# Altium schematic sheet 02_B2B_CON_P1-P100.SchDoc: PiMX8MP Board to board connector P1 - P100
size 420 x 297 mm; Author: T. Ludemann; SheetNumber: 2; SheetTotal: 8; DocSize: DINA3
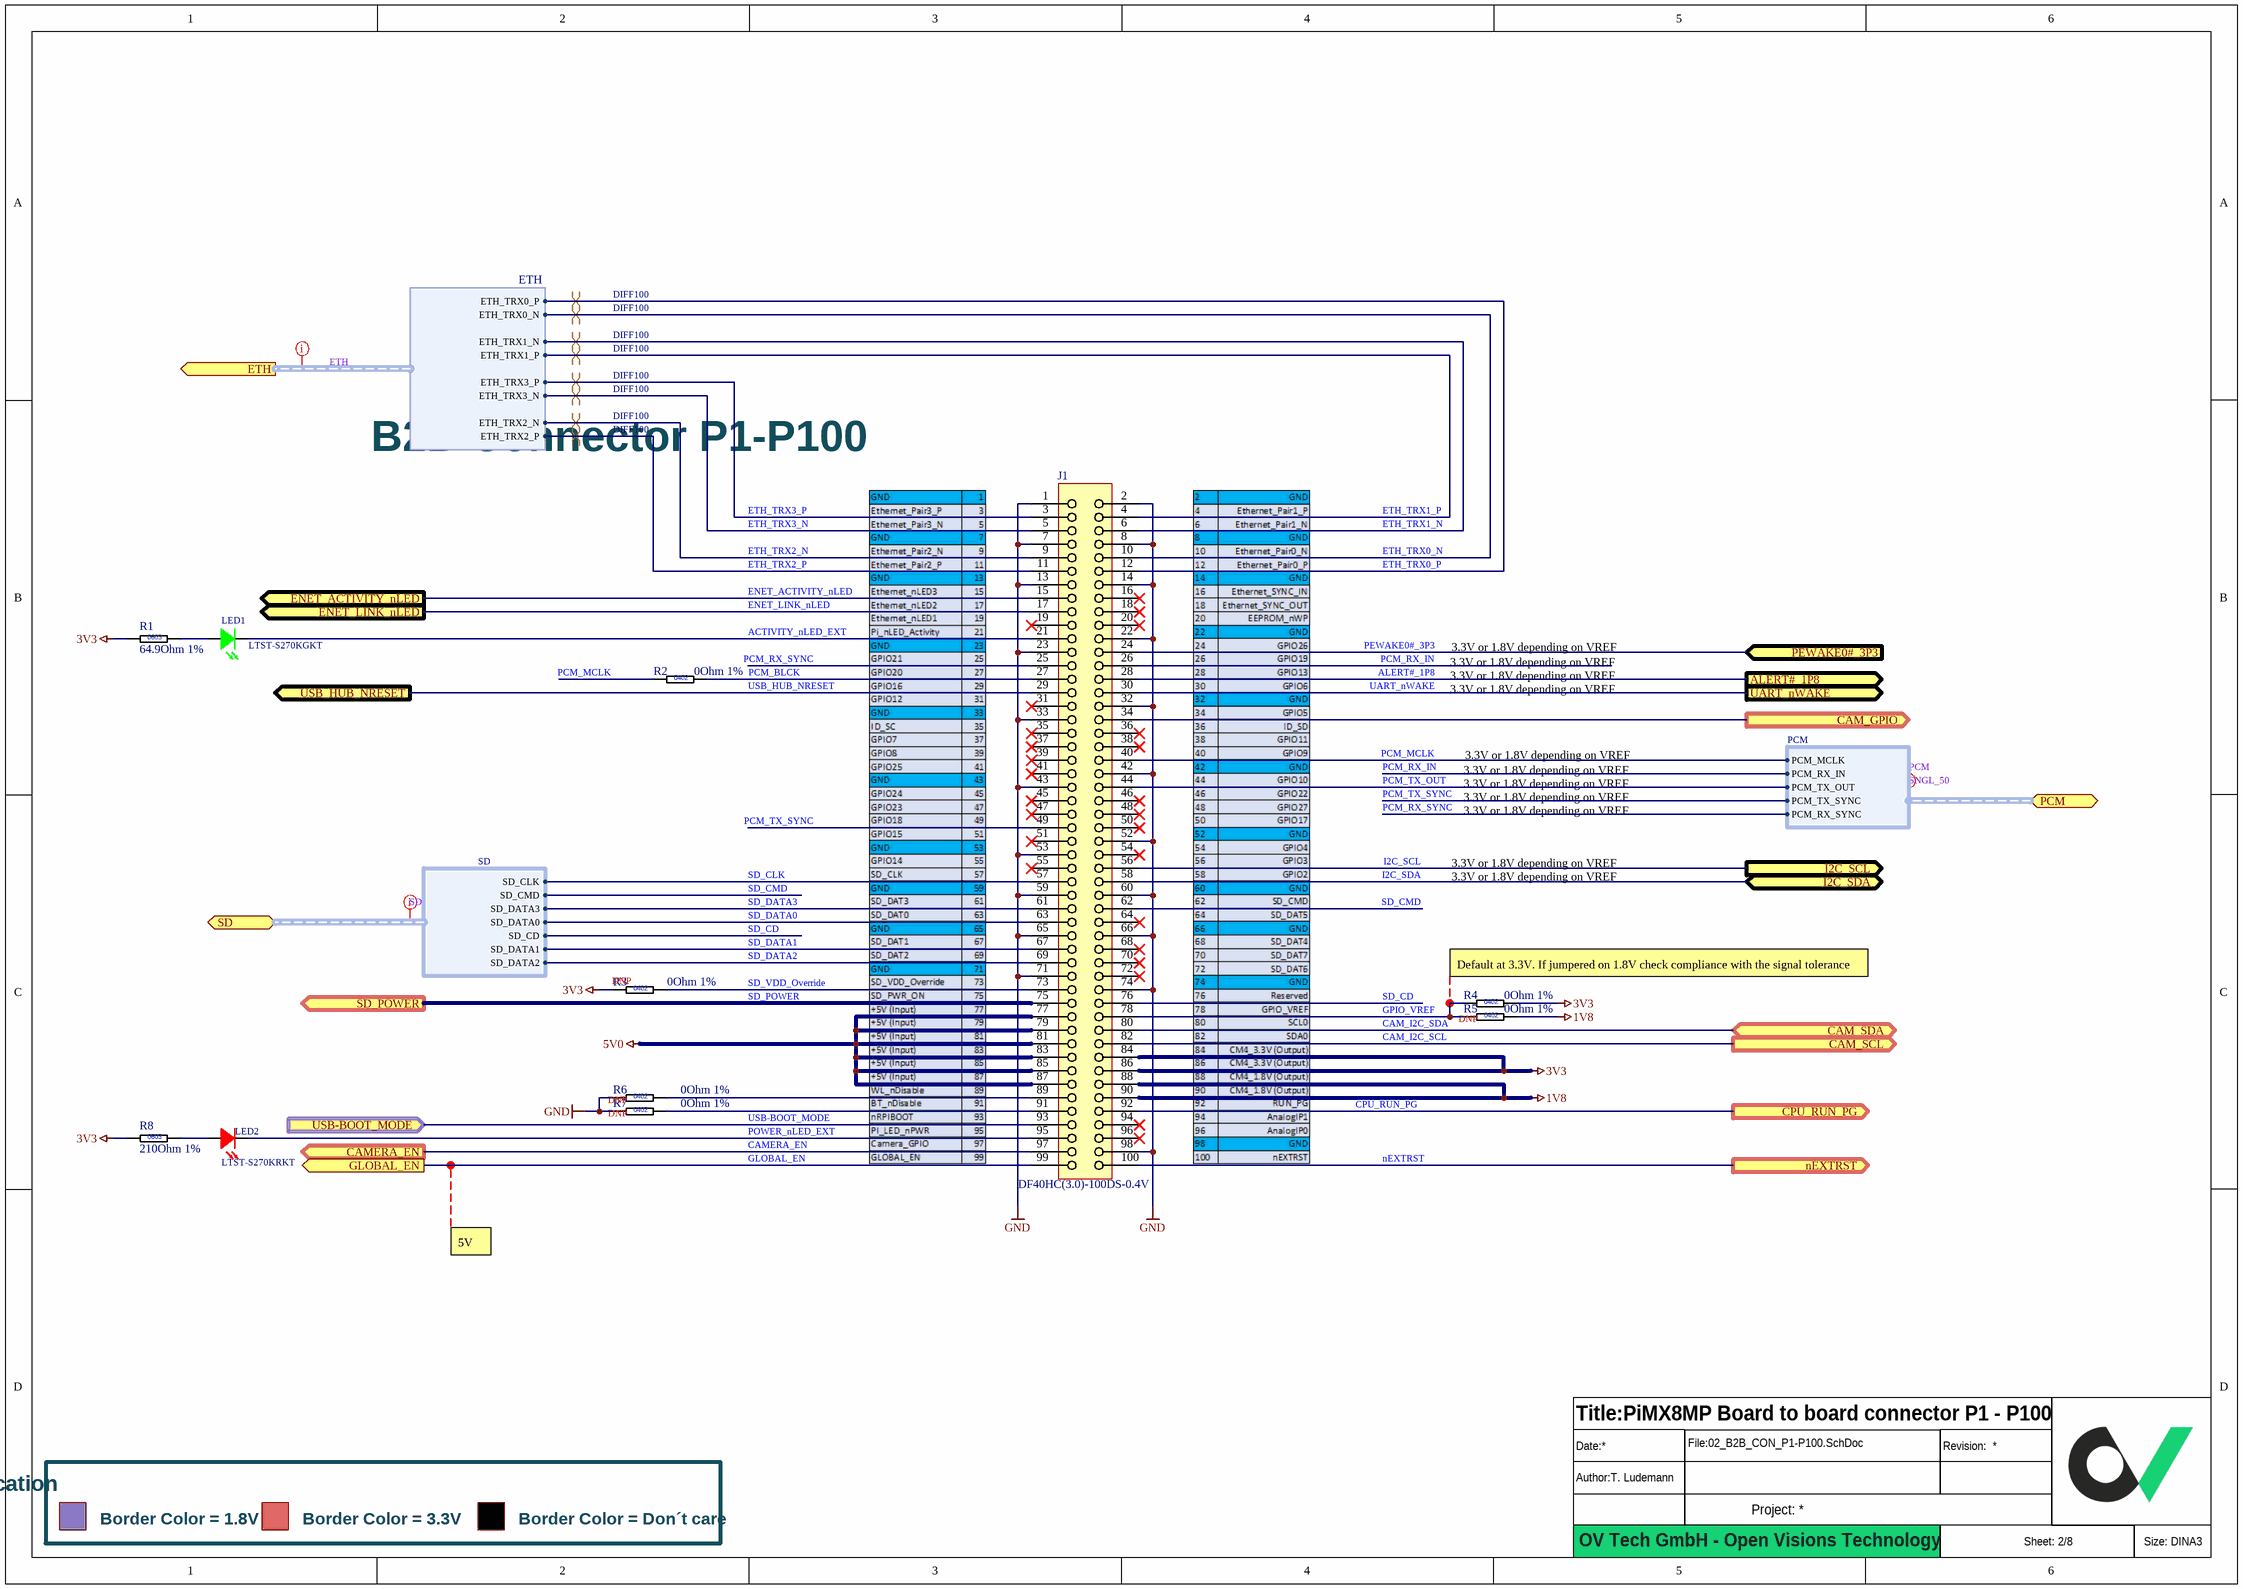
[diagram p0: 02_B2B_CON_P1-P100.SchDoc]

## Parts
?  (no value)  (graphical)
J1  DF40HC(3.0)-100DS-0.4V  [BOARD-TO-BOARD DF40HC(3.0)-100DS-0.4V]
LED1  LTST-S270KGKT  [LED 0605_LTST-S270KRKT]
LED2  LTST-S270KRKT  [LED 0605_LTST-S270KRKT]
R1  64.9Ohm 1%  [RESC1608X04L]
R2  0Ohm 1%  [RESC1005X04L]
R3  0Ohm 1%  [RESC1005X04L]
R4  0Ohm 1%  [RESC1005X04L]
R5  0Ohm 1%  [RESC1005X04L]
R6  0Ohm 1%  [RESC1005X04L]
R7  0Ohm 1%  [RESC1005X04L]
R8  210Ohm 1%  [RESC1608X04L]

## Ports
ALERT#_1P8 (out), CAM_GPIO (out), CAM_SCL (out), CAM_SDA (bidir), CAMERA_EN (out), CPU_RUN_PG (out), ENET_ACTIVITY_nLED (out), ENET_LINK_nLED (out), ETH (out, harness ETH), GLOBAL_EN (out), I2C_SCL (out), I2C_SDA (bidir), nEXTRST (out), PCM (bidir, harness PCM), PEWAKE0#_3P3 (in), SD (bidir, harness SD), SD_POWER (out), UART_nWAKE (out), USB-BOOT_MODE (in), USB_HUB_NRESET (out)

## Harnesses
ETH: ETH_TRX0_P, ETH_TRX0_N, ETH_TRX1_N, ETH_TRX1_P, ETH_TRX2_P, ETH_TRX2_N, ETH_TRX3_P, ETH_TRX3_N
SD: SD_CLK, SD_CMD, SD_CD, SD_DATA0, SD_DATA1, SD_DATA2, SD_DATA3
PCM: PCM_MCLK, PCM_TX_OUT, PCM_RX_IN, PCM_TX_SYNC, PCM_RX_SYNC

## Nets
1V8: J1.88 J1.90 R5.2
3V3: J1.84 J1.86 R1.1 R3.1 R4.2 R8.1
5V0: J1.77 J1.79 J1.81 J1.83 J1.85 J1.87
GND: J1.1 J1.2 J1.7 J1.8 J1.13 J1.14 J1.22 J1.23 J1.32 J1.33 J1.42 J1.43 J1.52 J1.53 J1.59 J1.60 J1.65 J1.66 J1.71 J1.74 J1.98 R6.1 R7.1
ACTIVITY_nLED_EXT: J1.21 LED1.1
ALERT#_1P8: J1.28 ; port ALERT#_1P8
CAM_GPIO: J1.34 ; port CAM_GPIO
CAM_I2C_SCL: J1.82 ; port CAM_SCL
CAM_I2C_SDA: J1.80 ; port CAM_SDA
CAMERA_EN: J1.97 ; port CAMERA_EN
CPU_RUN_PG: J1.92 ; port CPU_RUN_PG
ENET_ACTIVITY_nLED: J1.15 ; port ENET_ACTIVITY_nLED
ENET_LINK_nLED: J1.17 ; port ENET_LINK_nLED
ETH_TRX0_N: J1.10 ; port ETH.ETH_TRX0_N
ETH_TRX0_P: J1.12 ; port ETH.ETH_TRX0_P
ETH_TRX1_N: J1.6 ; port ETH.ETH_TRX1_N
ETH_TRX1_P: J1.4 ; port ETH.ETH_TRX1_P
ETH_TRX2_N: J1.9 ; port ETH.ETH_TRX2_N
ETH_TRX2_P: J1.11 ; port ETH.ETH_TRX2_P
ETH_TRX3_N: J1.5 ; port ETH.ETH_TRX3_N
ETH_TRX3_P: J1.3 ; port ETH.ETH_TRX3_P
GLOBAL_EN: J1.99 ; port GLOBAL_EN
GPIO_VREF: J1.78 R4.1 R5.1
I2C_SCL: J1.56 ; port I2C_SCL
I2C_SDA: J1.58 ; port I2C_SDA
nEXTRST: J1.100 ; port nEXTRST
PCM_BLCK: J1.27 R2.2
PCM_MCLK: J1.40 R2.1 ; port PCM.PCM_MCLK
PCM_RX_IN: J1.26 ; port PCM.PCM_RX_IN
PCM_RX_SYNC: J1.25 ; port PCM.PCM_RX_SYNC
PCM_TX_OUT: J1.44 ; port PCM.PCM_TX_OUT
PCM_TX_SYNC: J1.49 ; port PCM.PCM_TX_SYNC
PEWAKE0#_3P3: J1.24 ; port PEWAKE0#_3P3
POWER_nLED_EXT: J1.95 LED2.1
SD_CD: J1.76 ; port SD.SD_CD
SD_CLK: J1.57 ; port SD.SD_CLK
SD_CMD: J1.62 ; port SD.SD_CMD
SD_DATA0: J1.63 ; port SD.SD_DATA0
SD_DATA1: J1.67 ; port SD.SD_DATA1
SD_DATA2: J1.69 ; port SD.SD_DATA2
SD_DATA3: J1.61 ; port SD.SD_DATA3
SD_POWER: J1.75 ; port SD_POWER
SD_VDD_Override: J1.73 R3.2
UART_nWAKE: J1.30 ; port UART_nWAKE
USB-BOOT_MODE: J1.93 ; port USB-BOOT_MODE
USB_HUB_NRESET: J1.29 ; port USB_HUB_NRESET
NetJ1_89: J1.89 R6.2
NetJ1_91: J1.91 R7.2
NetLED1_2: LED1.2 R1.2
NetLED2_2: LED2.2 R8.2

Not connected (* = marked no-connect by the designer): J1 16* 18* 19* 20* 31* 35* 36* 37* 38* 39* 41* 45* 46* 47* 48* 50* 51* 54* 55* 64* 68* 70* 72* 94* 96*

## Layout directives
net class SD: (no net found under the mark)
net class ETH: (no net found under the mark)
differential pair; differential pair class DIFF100: ETH_TRX0_N, ETH_TRX0_P, ETH_TRX1_N, ETH_TRX1_P, ETH_TRX2_N, ETH_TRX2_P, ETH_TRX3_N, ETH_TRX3_P
net class PCM; net class SNGL_50: (no net found under the mark)

## Notes on the sheet
- (near J1) B2B Connector P1-P100
- 3.3V or 1.8V depending on VREF
- (near R3) DNP
- Default at 3.3V. If jumpered on 1.8V check compliance with the signal tolerance
- (near R5) DNP
- (near R6) DNP
- (near R7) DNP
- 5V
- Signal Level Indication
- Border Color = 1.8V
- Border Color = 3.3V
- Border Color = Don´t care
- OV Tech GmbH - Open Visions Technology
- (in symbol RES_0402_0R_1%) 0402
- (in symbol RES_0603_64.9R_1%) 0603
- (in symbol RES_0603_210R_1%) 0603

## Library data of the parts
? = Titleblock_01_OpenSource
J1 = Board to Board Connector Receptable_BTB_100P_04mm_DF40HC(3.0)-100DS-0.4V: Board to Board connector 100Pol Stacking Header Receptable  0.4mm Pitch; Manufacturer 1: Hirose Connector; Manufacturer 1 Prt. Nr.: DF40HC(3.0)-100DS-0.4V
LED1 = LED Green Sideview_LTST-S270KGKT: Standard LEDs 0605 Sideview - SMD Green Clear 571nm; Manufacturer 1: Lite-On; Manufacturer 1 Prt. Nr.: LTST-S270KGKT
LED2 = LED Red Sideview_LTST-S270KRKT: Standard LEDs 0605 Sideview - SMD Red Clear 631nm; Manufacturer 1: Lite-On; Manufacturer 1 Prt. Nr.: LTST-S270KRKT
R1 = RES_0603_64.9R_1%: Thick Film Resistors - SMD 64.9OHM 1%; Manufacturer 1: Vishay / Dale; Manufacturer 1 Prt. Nr.: CRCW060364R9FKEA; Manufacturer 2 Prt. Nr.: ERJ-3EKF64R9V; Manufacturer 2: Panasonic
R2-R7 = RES_0402_0R_1%: Thick Film Resistors - SMD 0OHM 1%; Manufacturer 1: Bourns; Manufacturer 1 Prt. Nr.: CR0402AJ/-000GAS; Manufacturer 2 Prt. Nr.: AC0402FR-070RL; Manufacturer 2: YAGEO
R8 = RES_0603_210R_1%: Thick Film Resistors - SMD 210OHM 1%; Manufacturer 1: Bourns; Manufacturer 1 Prt. Nr.: CR0603-FX-2100ELF; Manufacturer 2 Prt. Nr.: CRCW0603210RFKEA; Manufacturer 2: Vishay / Dale